# Altium schematic sheet joystick.SchDoc
size 61 x 53 mm
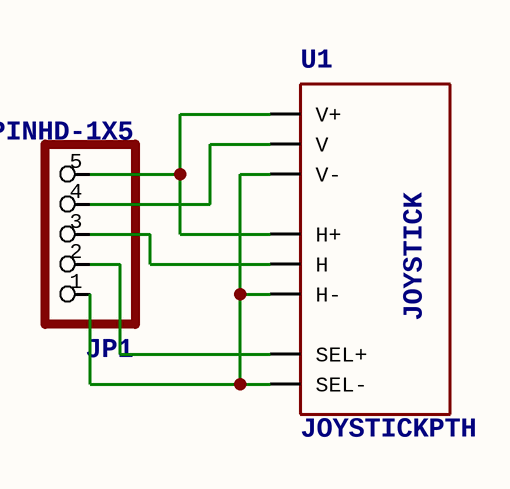
[diagram p0: joystick.SchDoc]

## Parts
JP1  >NAME: JP1  [1X05]  (hidden comment: PINHD-1X5)
U1  >Name: U1  [JOYSTICK]  (hidden comment: JOYSTICKPTH)

## Nets
NetJP1_1: JP1.1 U1.B2A(SEL-) U1.H3(H-) U1.V3(V-)
NetJP1_2: JP1.2 U1.B1A(SEL+)
NetJP1_3: JP1.3 U1.H2(H)
NetJP1_4: JP1.4 U1.V2(V)
NetJP1_5: JP1.5 U1.H1(H+) U1.V1(V+)

## Library data of the parts
JP1 = PINHD-1X5: <b>PIN HEADER</b>; >VALUE: PINHD-1X5
U1 = JOYSTICKPTH: <b>Thumb Joystick</b> / Joystick commonly found in PS2 controllers. Two pots and a select switch. Adapted from Sparkfun Library (but for more common 6mm switch sticks); >Value: JOYSTICKPTH; JOYSTICK: JOYSTICK